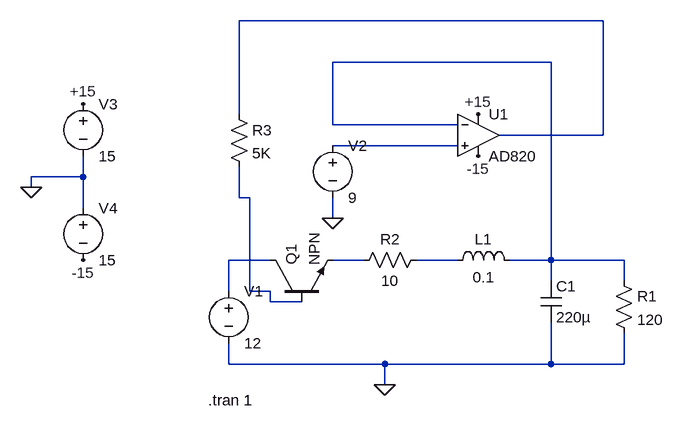
[diagram p0: schematic Circuito_RLC_Controlador_ONOFF.asc]
Circuito_RLC_Controlador_ONOFF.asc, the LTspice schematic file:
Version 4
SHEET 1 944 680
WIRE 592 -272 32 -272
WIRE 512 -208 176 -208
WIRE 32 -128 32 -272
WIRE 176 -112 176 -208
WIRE 368 -112 176 -112
WIRE 592 -96 592 -272
WIRE 592 -96 432 -96
WIRE 368 -80 176 -80
WIRE -208 -32 -208 -64
WIRE -208 -32 -288 -32
WIRE -288 -16 -288 -32
WIRE 32 0 32 -48
WIRE 48 0 32 0
WIRE -208 16 -208 -32
WIRE 176 32 176 0
WIRE 80 96 16 96
WIRE 224 96 176 96
WIRE 368 96 304 96
WIRE 512 96 512 -208
WIRE 512 96 448 96
WIRE 624 96 512 96
WIRE 512 128 512 96
WIRE 624 128 624 96
WIRE 16 144 16 96
WIRE 48 144 48 0
WIRE 80 144 48 144
WIRE 80 160 80 144
WIRE 128 160 80 160
WIRE 16 256 16 224
WIRE 256 256 16 256
WIRE 512 256 512 192
WIRE 512 256 256 256
WIRE 624 256 624 208
WIRE 624 256 512 256
WIRE 256 288 256 256
FLAG 256 288 0
FLAG 176 32 0
FLAG -288 -16 0
FLAG -208 -144 +15
FLAG 400 -128 +15
FLAG -208 96 -15
FLAG 400 -64 -15
SYMBOL voltage 16 128 R0
WINDOW 123 0 0 Left 0
WINDOW 39 0 0 Left 0
SYMATTR InstName V1
SYMATTR Value 12
SYMBOL res 320 80 R90
WINDOW 0 0 56 VBottom 2
WINDOW 3 32 56 VTop 2
SYMATTR InstName R2
SYMATTR Value 10
SYMBOL ind 352 112 R270
WINDOW 0 32 56 VTop 2
WINDOW 3 5 56 VBottom 2
SYMATTR InstName L1
SYMATTR Value 0.1
SYMBOL cap 496 128 R0
SYMATTR InstName C1
SYMATTR Value 220µ
SYMBOL res 608 112 R0
SYMATTR InstName R1
SYMATTR Value 120
SYMBOL OpAmps\\AD820 400 -160 R0
SYMATTR InstName U1
SYMBOL voltage 176 -96 R0
WINDOW 123 0 0 Left 0
WINDOW 39 0 0 Left 0
SYMATTR InstName V2
SYMATTR Value 9
SYMBOL voltage -208 -160 R0
WINDOW 123 0 0 Left 0
WINDOW 39 0 0 Left 0
SYMATTR InstName V3
SYMATTR Value 15
SYMBOL voltage -208 0 R0
WINDOW 123 0 0 Left 0
WINDOW 39 0 0 Left 0
SYMATTR InstName V4
SYMATTR Value 15
SYMBOL npn 80 160 R270
SYMATTR InstName Q1
SYMBOL res 16 -144 R0
SYMATTR InstName R3
SYMATTR Value 5K
TEXT -16 312 Left 2 !.tran 1

The netlist it stands for:
* Circuito_RLC_Controlador_ONOFF.asc
V1 N005 0 12
R2 N007 N006 10
L1 N007 N002 0.1
C1 N002 0 220µ
R1 N002 0 120
XU1 N003 N002 +15 -15 N001 AD820  ; pins In+ In- V+ V- OUT
V2 N003 0 9
V3 +15 0 15
V4 0 -15 15
Q1 N005 N004 N006 0 NPN
R3 N001 N004 5K
.model NPN NPN
.model PNP PNP
.lib standard.bjt
.tran 1
.backanno
.end